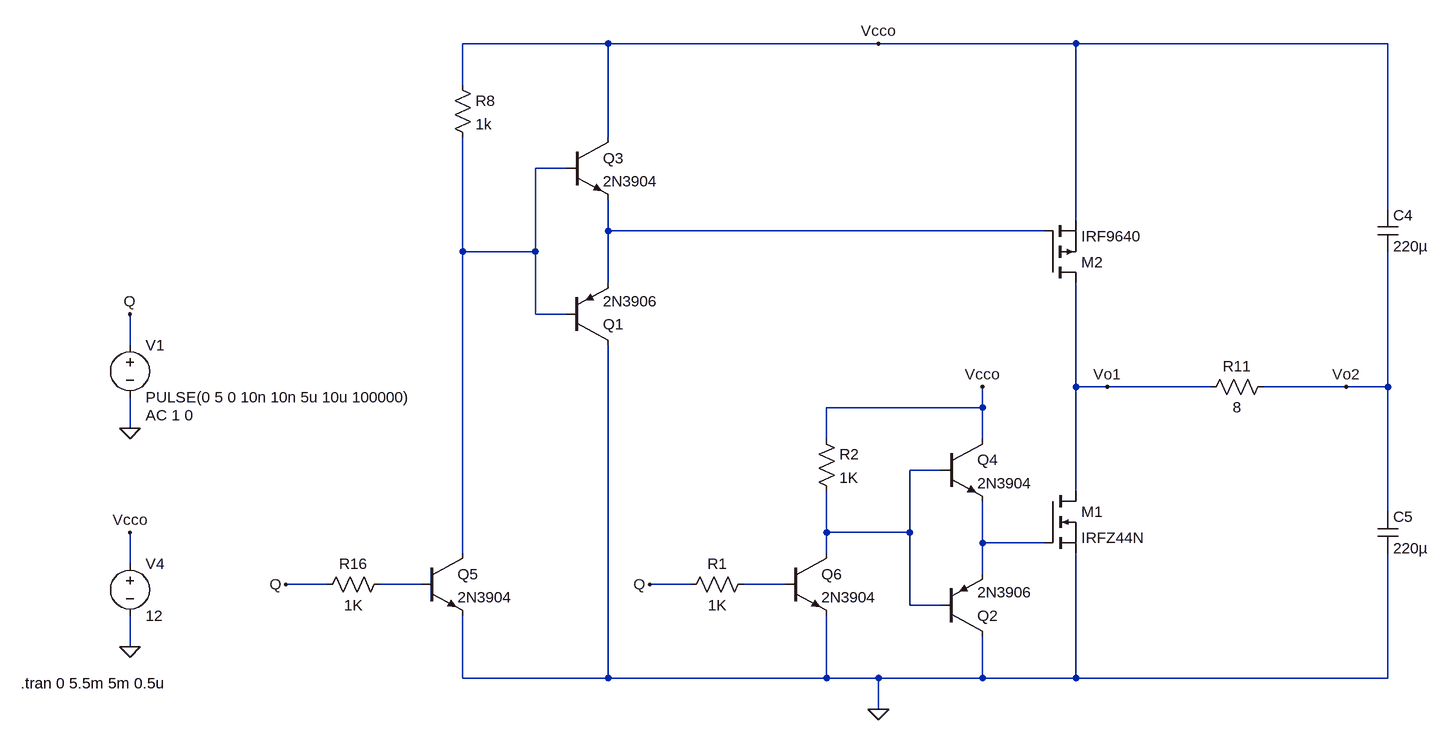
[diagram p0: schematic output.asc]
output.asc, the LTspice schematic file:
Version 4
SHEET 1 2904 980
WIRE 848 -304 624 -304
WIRE 1264 -304 848 -304
WIRE 1568 -304 1264 -304
WIRE 2048 -304 1568 -304
WIRE 624 -240 624 -304
WIRE 848 -160 848 -304
WIRE 784 -112 736 -112
WIRE 2048 -48 2048 -304
WIRE 1568 -32 1568 -304
WIRE 848 -16 848 -64
WIRE 1520 -16 848 -16
WIRE 624 16 624 -160
WIRE 736 16 736 -112
WIRE 736 16 624 16
WIRE 848 64 848 -16
WIRE 736 112 736 16
WIRE 784 112 736 112
WIRE 112 160 112 112
WIRE 1568 224 1568 64
WIRE 1616 224 1568 224
WIRE 1776 224 1616 224
WIRE 1984 224 1856 224
WIRE 2048 224 2048 16
WIRE 2048 224 1984 224
WIRE 1424 256 1424 224
WIRE 1424 256 1184 256
WIRE 112 288 112 240
WIRE 1184 304 1184 256
WIRE 1424 304 1424 256
WIRE 1360 352 1312 352
WIRE 1568 384 1568 224
WIRE 2048 416 2048 224
WIRE 1184 448 1184 384
WIRE 1312 448 1312 352
WIRE 1312 448 1184 448
WIRE 1424 464 1424 400
WIRE 1520 464 1424 464
WIRE 624 480 624 16
WIRE 1184 480 1184 448
WIRE 112 496 112 448
WIRE 1424 512 1424 464
WIRE 416 528 352 528
WIRE 560 528 496 528
WIRE 976 528 912 528
WIRE 1120 528 1056 528
WIRE 1312 560 1312 448
WIRE 1360 560 1312 560
WIRE 112 624 112 576
WIRE 624 672 624 576
WIRE 848 672 848 160
WIRE 848 672 624 672
WIRE 1184 672 1184 576
WIRE 1184 672 848 672
WIRE 1264 672 1184 672
WIRE 1424 672 1424 608
WIRE 1424 672 1264 672
WIRE 1568 672 1568 480
WIRE 1568 672 1424 672
WIRE 2048 672 2048 480
WIRE 2048 672 1568 672
WIRE 1264 720 1264 672
FLAG 1264 720 0
FLAG 1264 -304 Vcco
FLAG 912 528 Q
FLAG 352 528 Q
FLAG 1616 224 Vo1
FLAG 1984 224 Vo2
FLAG 112 624 0
FLAG 112 448 Vcco
FLAG 1424 224 Vcco
FLAG 112 288 0
FLAG 112 112 Q
SYMBOL pnp 784 160 M180
SYMATTR InstName Q1
SYMATTR Value 2N3906
SYMBOL pnp 1360 608 M180
SYMATTR InstName Q2
SYMATTR Value 2N3906
SYMBOL npn 784 -160 R0
SYMATTR InstName Q3
SYMATTR Value 2N3904
SYMBOL npn 1360 304 R0
SYMATTR InstName Q4
SYMATTR Value 2N3904
SYMBOL npn 560 480 R0
SYMATTR InstName Q5
SYMATTR Value 2N3904
SYMBOL res 608 -256 R0
SYMATTR InstName R8
SYMATTR Value 1k
SYMBOL nmos 1520 384 R0
SYMATTR InstName M1
SYMATTR Value IRFZ44N
SYMBOL pmos 1520 64 M180
SYMATTR InstName M2
SYMATTR Value IRF9640
SYMBOL cap 2032 -48 R0
SYMATTR InstName C4
SYMATTR Value 220µ
SYMBOL cap 2032 416 R0
SYMATTR InstName C5
SYMATTR Value 220µ
SYMBOL res 1872 208 R90
WINDOW 0 0 56 VBottom 2
WINDOW 3 32 56 VTop 2
SYMATTR InstName R11
SYMATTR Value 8
SYMBOL voltage 112 480 R0
WINDOW 123 0 0 Left 2
WINDOW 39 0 0 Left 2
SYMATTR InstName V4
SYMATTR Value 12
SYMBOL res 512 512 R90
WINDOW 0 0 56 VBottom 2
WINDOW 3 32 56 VTop 2
SYMATTR InstName R16
SYMATTR Value 1K
SYMBOL voltage 112 144 R0
WINDOW 123 24 124 Left 2
WINDOW 39 0 0 Left 2
SYMATTR Value2 AC 1 0
SYMATTR InstName V1
SYMATTR Value PULSE(0 5 0 10n 10n 5u 10u 100000)
SYMBOL npn 1120 480 R0
SYMATTR InstName Q6
SYMATTR Value 2N3904
SYMBOL res 1072 512 R90
WINDOW 0 0 56 VBottom 2
WINDOW 3 32 56 VTop 2
SYMATTR InstName R1
SYMATTR Value 1K
SYMBOL res 1168 288 R0
SYMATTR InstName R2
SYMATTR Value 1K
TEXT -56 680 Left 2 !.tran 0 5.5m 5m 0.5u

The netlist it stands for:
* output.asc
Q1 0 N001 N002 0 2N3906
Q2 0 N003 N004 0 2N3906
Q3 Vcco N001 N002 0 2N3904
Q4 Vcco N003 N004 0 2N3904
Q5 N001 N005 0 0 2N3904
R8 Vcco N001 1k
M1 Vo1 N004 0 0 IRFZ44N
M2 Vo1 N002 Vcco Vcco IRF9640
C4 Vcco Vo2 220µ
C5 Vo2 0 220µ
R11 Vo2 Vo1 8
V4 Vcco 0 12
R16 N005 Q 1K
V1 Q 0 PULSE(0 5 0 10n 10n 5u 10u 100000) AC 1 0
Q6 N003 N006 0 0 2N3904
R1 N006 Q 1K
R2 Vcco N003 1K
.model NPN NPN
.model PNP PNP
.lib standard.bjt
.model NMOS NMOS
.model PMOS PMOS
.lib standard.mos
.tran 0 5.5m 5m 0.5u
.backanno
.end